# EAGLE schematic 2x4_v1_CS (EAGLE 5.06)
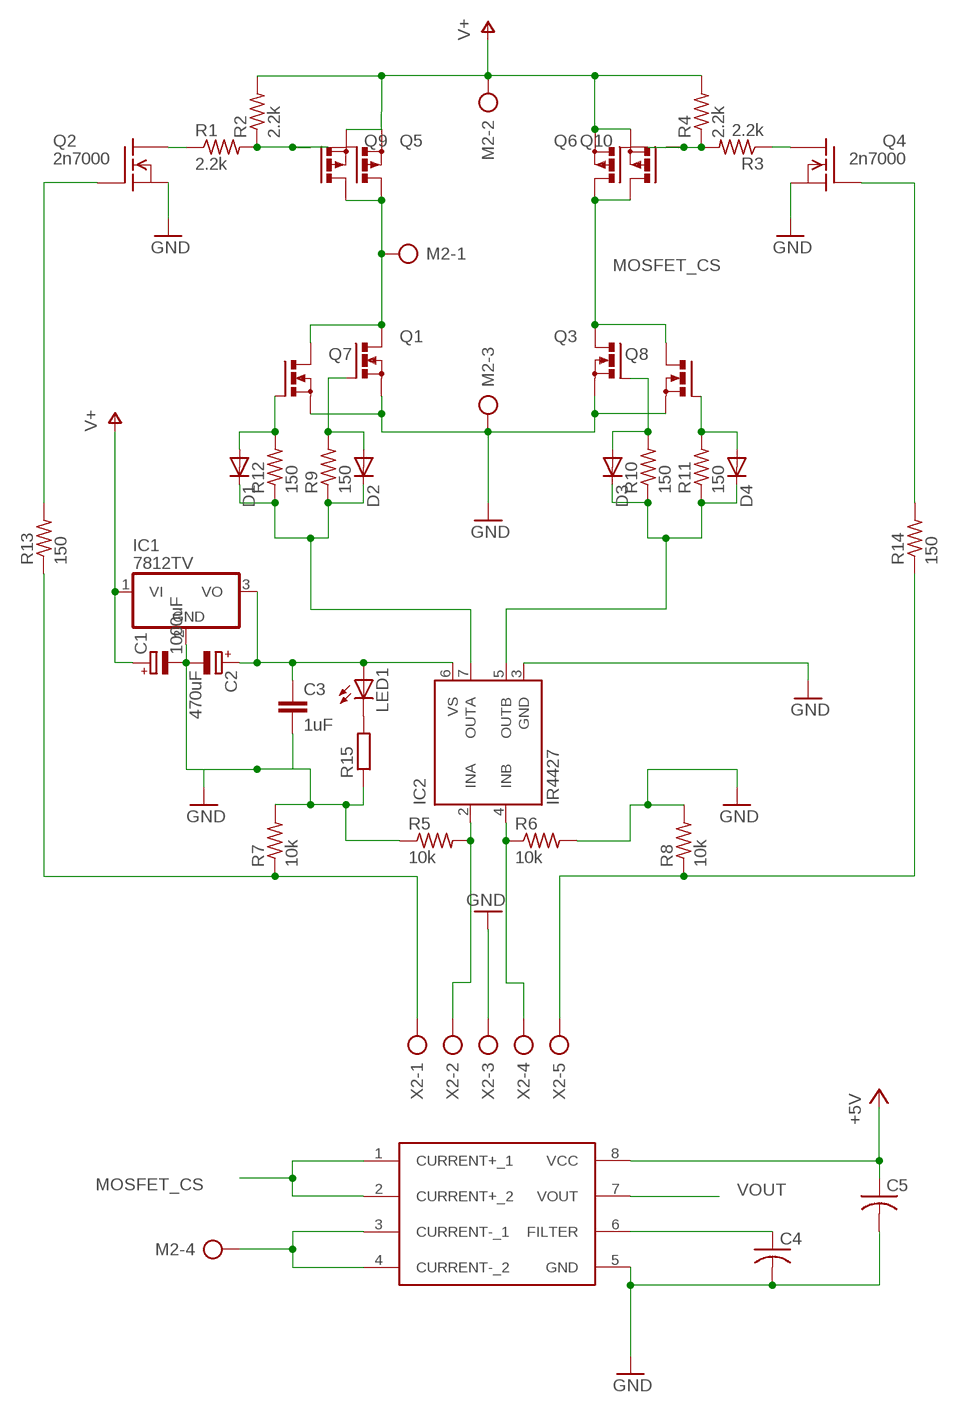
[diagram p0: schematic, sheet 1]

## Parts
ACS714  ACS714  [ACS714]
C1  1000uF  CPOL-EUE5-8.5  [E5-8,5]
C2  470uF  CPOL-EUE5-8.5  [E5-8,5]
C3  1uF  C-EU025-024X044  [C025-024X044]
C4  C-US050-024X044  [C050-024X044]
C5  C-US050-024X044  [C050-024X044]
D1  d914  DIODE1N4148  [DIODE-1N4148]
D2  d914  DIODE1N4148  [DIODE-1N4148]
D3  d914  DIODE1N4148  [DIODE-1N4148]
D4  d914  DIODE1N4148  [DIODE-1N4148]
IC1  7812TV  [TO220V]
IC2  IR4427  [DIL08]
LED1  LED3MM  [LED3MM]
M2  AK500/4  [AK500/4]
Q1  PMOSFET_NTO220BV  [TO220BV]
Q2  2n7000  VN0106N9  [TO-52]
Q3  PMOSFET_NTO220BV  [TO220BV]
Q4  2n7000  VN0106N9  [TO-52]
Q5  PMOSFET_PTO220BV  [TO220BV]
Q6  PMOSFET_PTO220BV  [TO220BV]
Q7  PMOSFET_NTO220BV  [TO220BV]
Q8  PMOSFET_NTO220BV  [TO220BV]
Q9  PMOSFET_PTO220BV  [TO220BV]
Q10  PMOSFET_PTO220BV  [TO220BV]
R1  2.2k  R-US_0204/5  [0204/5]
R2  2.2k  R-US_0204/7  [0204/7]
R3  2.2k  R-US_0204/5  [0204/5]
R4  2.2k  R-US_0204/7  [0204/7]
R5  10k  R-US_0204/5  [0204/5]
R6  10k  R-US_0204/5  [0204/5]
R7  10k  R-US_0204/7  [0204/7]
R8  10k  R-US_0204/7  [0204/7]
R9  150  R-US_0204/7  [0204/7]
R10  150  R-US_0204/7  [0204/7]
R11  150  R-US_0204/7  [0204/7]
R12  150  R-US_0204/7  [0204/7]
R13  150  R-US_0204/7  [0204/7]
R14  150  R-US_0204/7  [0204/7]
R15  R-EU_0204/5  [0204/5]
X2  AK500/5  [AK500/5]

## Nets
+5V: ACS714.8(VCC) C5.1
GND: ACS714.5(GND) C1.- C2.- C3.2 C4.2 C5.2 IC1.2(GND) IC2.3(GND) M2.3 Q1.S Q2.1(S) Q3.S Q4.1(S) Q7.S Q8.S R5.1 R6.2 R7.2 R8.2 R15.1 X2.3
MOSFET_CS: ACS714.1(CURRENT+_1) ACS714.2(CURRENT+_2) Q3.D Q6.D Q8.D Q10.D
N$1: Q4.2(G) R14.2
N$2: Q5.G Q9.G R1.2 R2.1
N$3: Q6.G Q10.G R3.2 R4.1
N$5: M2.1 Q1.D Q5.D Q7.D Q9.D
N$6: ACS714.3(CURRENT-_1) ACS714.4(CURRENT-_2) M2.4
N$7: Q2.3(D) R1.1
N$9: Q4.3(D) R3.1
N$10: R7.1 R13.1 X2.1
N$11: R8.1 R14.1 X2.5
N$12: IC2.4(INB) R6.1 X2.4
N$13: IC2.2(INA) R5.2 X2.2
N$14: D2.A Q1.G R9.2
N$15: ACS714.6(FILTER) C4.1
N$16: C2.+ C3.1 IC1.3(VO) IC2.6(VS) LED1.A
N$17: D3.A Q3.G R10.2
N$18: D3.C D4.C IC2.5(OUTB) R10.1 R11.1
N$19: D1.C D2.C IC2.7(OUTA) R9.1 R12.1
N$20: D1.A Q7.G R12.2
N$21: D4.A Q8.G R11.2
N$22: LED1.K(C) R15.2
N$24: Q2.2(G) R13.2
V+: C1.+ IC1.1(VI) M2.2 Q5.S Q6.S Q9.S Q10.S R2.2 R4.2
VOUT: ACS714.7(VOUT)

## Library data of the parts
ACS714 = A-JD3:ACS714
C1 C2 = rcl:CPOL-EU: POLARIZED CAPACITOR, European symbol
C3 = rcl:C-EU: CAPACITOR, European symbol
C4 C5 = rcl:C-US: CAPACITOR, American symbol
D1-D4 = SparkFun:DIODE: Diode These are standard reverse protection diodes and small signal diodes. SMA package can handle up to about 1A. SOD-323 can handle about 200mA. What the SOD-323 package when ordering, there are some mfgs out there that are 5-pin packages.
IC1 = linear:78*: Positive VOLTAGE REGULATOR Source: http://cache.national.com/ds/LM/LM78L05.pdf http://www.fairchildsemi.com/ds/LM/LM7805.pdf
IC2 = ir:IR4427: DUAL LOW SIDE DRIVER Source: ID4426.pdf
LED1 = SparkFun:LED: LEDs Standard schematic elements and footprints for 5mm, 3mm, 1206, and 0603 sized LEDs. 5mm - Spark Fun Electronics SKU : COM-00529 (and others)
M2 = con-ptr500:AK500/4: CONNECTOR
Q1 Q3 Q7 Q8 = transistor-power:PMOSFET_N: Power MOSFET N-Channel
Q2 Q4 = transistor-fet:VN0106N9: N-Channel Enhancement MOSFET 60V; 0,5A; 3,0Ohm
Q5 Q6 Q9 Q10 = transistor-power:PMOSFET_P: Power MOSFET P-Channel
R1-R4 R7 R13 = resistor:R-US_: RESISTOR, American symbol
R5 R6 R8-R12 R14 = rcl:R-US_: RESISTOR, American symbol
R15 = resistor:R-EU_: RESISTOR, European symbol
X2 = con-ptr500:AK500/5: CONNECTOR